# EAGLE schematic Circuit_DevBoard (EAGLE 9.6.2)
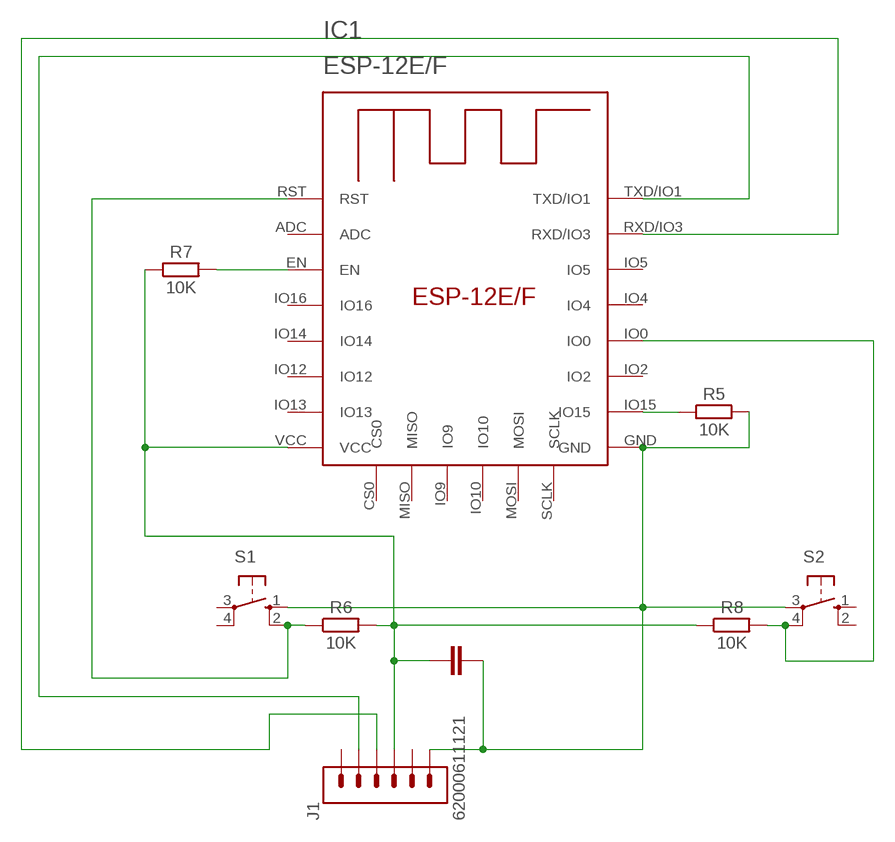
[diagram p0: schematic, sheet 1]

## Parts
IC1  ESP-12E/F  [ESP-12E]
J1  62000611121  [62000611121]
R5  10K  R_AXIAL-7.2MM-PITCH  [RESAD724W46L381D178B]
R6  10K  R_AXIAL-7.2MM-PITCH  [RESAD724W46L381D178B]
R7  10K  R_AXIAL-7.2MM-PITCH  [RESAD724W46L381D178B]
R8  10K  R_AXIAL-7.2MM-PITCH  [RESAD724W46L381D178B]
S1  10-XX  [B3F-10XX]
S2  10-XX  [B3F-10XX]

## Nets
N$1: IC1.EN R7.2
N$2: IC1.IO15 R5.1
N$3: IC1.RST R6.1 S1.2(S1)
N$4: IC1.GND J1.6 R5.2 S1.1(S) S2.3(P)
N$5: IC1.VCC J1.4 R6.2 R7.1 R8.1
N$6: IC1.IO0 R8.2 S2.4(P1)
N$7: IC1.RXD/IO3 J1.3
N$8: IC1.TXD/IO1 J1.2
Unconnected: IC1.ADC IC1.CS0 IC1.IO2 IC1.IO4 IC1.IO5 IC1.IO9 IC1.IO10 IC1.IO12 IC1.IO13 IC1.IO14 IC1.IO16 IC1.MISO IC1.MOSI IC1.SCLK J1.1 J1.5 S1.3(P) S1.4(P1) S2.1(S) S2.2(S1)

## Library data of the parts
IC1 = esp-12e-f:ESP-12E/F
J1 = Headers:62000611121: THT Vertical Pin Header WR-PHD, Pitch 2.00 mm, Single Row, 6 pins Manufacturer's datasheet <https://datasheet.octopart.com/62000611121-W%C3%BCrth-Elektronik-datasheet-117282008.pdf>; CREATED_BY: PCBLayout.com; MANUFACTURER: Würth Elektronik; MPN: 62000611121
R5-R8 = Resistor:R: Resistor Fixed - Generic; CATEGORY: Resistor; SUB-CATEGORY: Fixed
S1 S2 = switch-omron:10-XX: OMRON SWITCH; MPN: B3F-1000; OC_FARNELL: 176432; OC_NEWARK: 36M3542